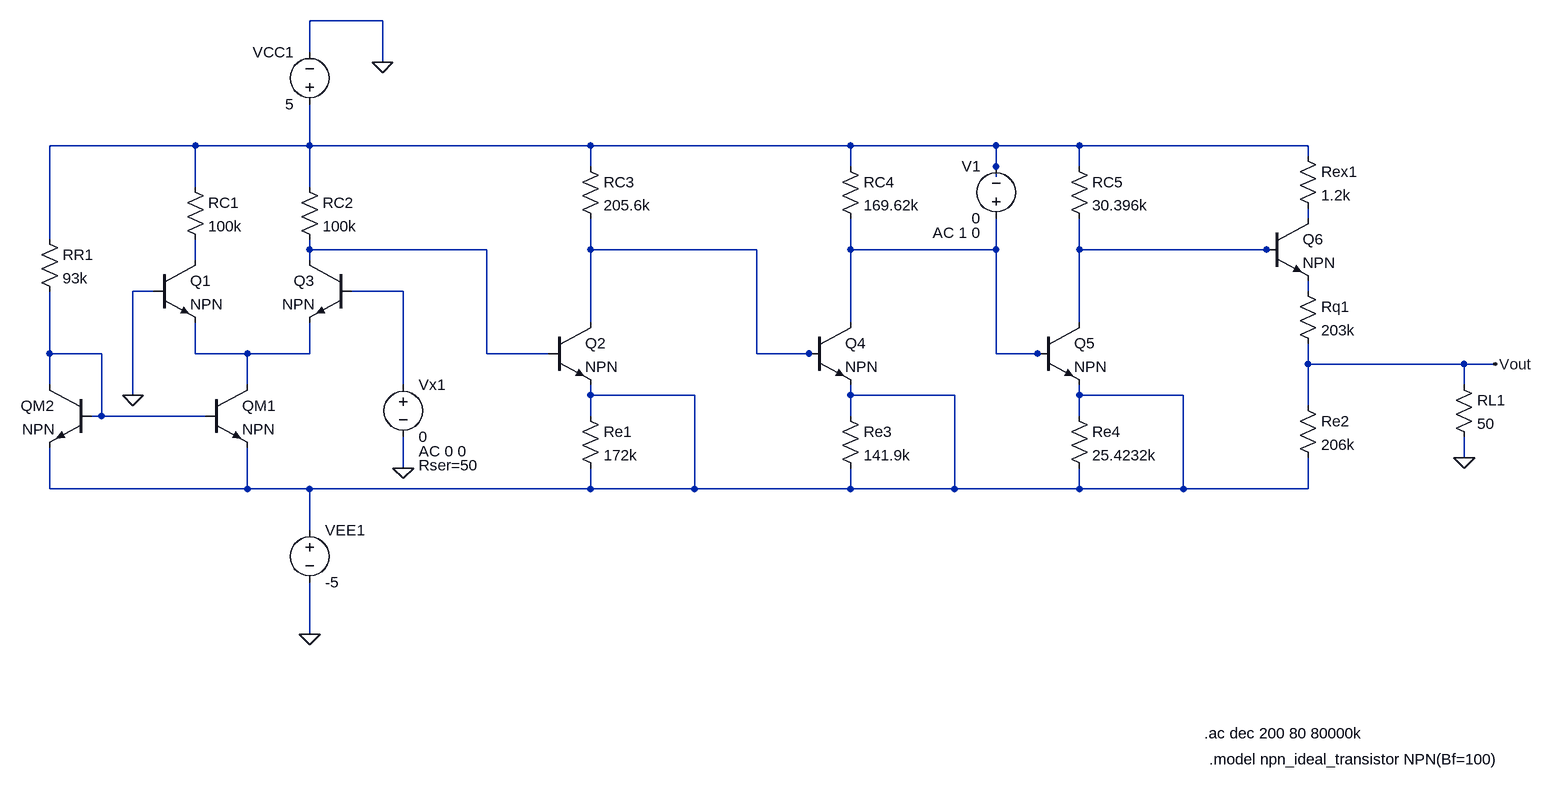
[diagram p0: schematic Draft1.asc]
Draft1.asc, the LTspice schematic file:
Version 4
SHEET 1 1828 992
WIRE 48 -160 -64 -160
WIRE -64 -112 -64 -160
WIRE 48 -96 48 -160
WIRE -240 32 -464 32
WIRE -64 32 -64 -32
WIRE -64 32 -240 32
WIRE 368 32 -64 32
WIRE 768 32 368 32
WIRE 992 32 768 32
WIRE 1120 32 992 32
WIRE 1472 32 1120 32
WIRE 1472 48 1472 32
WIRE 368 64 368 32
WIRE 768 64 768 32
WIRE 992 64 992 32
WIRE 1120 64 1120 32
WIRE 992 80 992 64
WIRE -240 96 -240 32
WIRE -64 96 -64 32
WIRE 1472 144 1472 128
WIRE -464 176 -464 32
WIRE -64 192 -64 176
WIRE 208 192 -64 192
WIRE 368 192 368 144
WIRE 624 192 368 192
WIRE 768 192 768 144
WIRE 992 192 992 144
WIRE 992 192 768 192
WIRE 1120 192 1120 144
WIRE 1408 192 1120 192
WIRE 1424 192 1408 192
WIRE -240 208 -240 176
WIRE -64 208 -64 192
WIRE -304 256 -336 256
WIRE 80 256 0 256
WIRE 1472 256 1472 240
WIRE 368 304 368 192
WIRE 768 304 768 192
WIRE 1120 304 1120 192
WIRE -464 352 -464 256
WIRE -384 352 -464 352
WIRE -240 352 -240 304
WIRE -160 352 -240 352
WIRE -64 352 -64 304
WIRE -64 352 -160 352
WIRE 208 352 208 192
WIRE 304 352 208 352
WIRE 624 352 624 192
WIRE 704 352 624 352
WIRE 720 352 704 352
WIRE 992 352 992 192
WIRE 1056 352 992 352
WIRE 1072 352 1056 352
WIRE 1472 368 1472 336
WIRE 1712 368 1472 368
WIRE 1760 368 1712 368
WIRE -464 400 -464 352
WIRE -160 400 -160 352
WIRE 80 400 80 256
WIRE 1712 400 1712 368
WIRE -336 416 -336 256
WIRE 368 416 368 400
WIRE 528 416 368 416
WIRE 768 416 768 400
WIRE 928 416 768 416
WIRE 1120 416 1120 400
WIRE 1280 416 1120 416
WIRE 1472 432 1472 368
WIRE -384 448 -384 352
WIRE -384 448 -400 448
WIRE -224 448 -384 448
WIRE 368 448 368 416
WIRE 768 448 768 416
WIRE 1120 448 1120 416
WIRE 1712 512 1712 480
WIRE 80 528 80 480
WIRE -464 560 -464 496
WIRE -160 560 -160 496
WIRE -160 560 -464 560
WIRE -64 560 -160 560
WIRE 368 560 368 528
WIRE 368 560 -64 560
WIRE 528 560 528 416
WIRE 528 560 368 560
WIRE 768 560 768 528
WIRE 768 560 528 560
WIRE 928 560 928 416
WIRE 928 560 768 560
WIRE 1120 560 1120 528
WIRE 1120 560 928 560
WIRE 1280 560 1280 416
WIRE 1280 560 1120 560
WIRE 1472 560 1472 512
WIRE 1472 560 1280 560
WIRE -64 624 -64 560
WIRE -64 784 -64 704
FLAG -64 784 0
FLAG 48 -96 0
FLAG 80 528 0
FLAG 1712 512 0
FLAG 1760 368 Vout
FLAG -336 416 0
SYMBOL res -256 80 R0
SYMATTR InstName RC1
SYMATTR Value 100k
SYMBOL res -80 80 R0
SYMATTR InstName RC2
SYMATTR Value 100k
SYMBOL Res 352 432 R0
SYMATTR InstName Re1
SYMATTR Value 172k
SYMBOL Res -480 160 R0
SYMATTR InstName RR1
SYMATTR Value 93k
SYMBOL Res 352 48 R0
SYMATTR InstName RC3
SYMATTR Value 205.6k
SYMBOL npn -304 208 R0
SYMATTR InstName Q1
SYMBOL npn 304 304 R0
SYMATTR InstName Q2
SYMBOL npn -224 400 R0
SYMATTR InstName QM1
SYMBOL npn -400 400 M0
SYMATTR InstName QM2
SYMBOL npn 0 208 M0
SYMATTR InstName Q3
SYMBOL voltage -64 608 R0
SYMATTR InstName VEE1
SYMATTR Value -5
SYMBOL voltage -64 -16 R180
WINDOW 0 24 96 Left 2
WINDOW 3 24 16 Left 2
SYMATTR InstName VCC1
SYMATTR Value 5
SYMBOL voltage 80 384 R0
WINDOW 123 24 118 Left 2
WINDOW 39 24 140 Left 2
SYMATTR Value2 AC 0 0
SYMATTR SpiceLine Rser=50
SYMATTR InstName Vx1
SYMATTR Value 0
SYMBOL Res 1456 416 R0
SYMATTR InstName Re2
SYMATTR Value 206k
SYMBOL Res 1696 384 R0
SYMATTR InstName RL1
SYMATTR Value 50
SYMBOL Res 752 432 R0
SYMATTR InstName Re3
SYMATTR Value 141.9k
SYMBOL Res 752 48 R0
SYMATTR InstName RC4
SYMATTR Value 169.62k
SYMBOL npn 704 304 R0
SYMATTR InstName Q4
SYMBOL Res 1456 240 R0
SYMATTR InstName Rq1
SYMATTR Value 203k
SYMBOL Res 1104 432 R0
SYMATTR InstName Re4
SYMATTR Value 25.4232k
SYMBOL Res 1104 48 R0
SYMATTR InstName RC5
SYMATTR Value 30.396k
SYMBOL npn 1056 304 R0
SYMATTR InstName Q5
SYMBOL npn 1408 144 R0
SYMATTR InstName Q6
SYMBOL Res 1456 32 R0
SYMATTR InstName Rex1
SYMATTR Value 1.2k
SYMBOL Voltage 992 160 R180
WINDOW 0 24 96 Left 2
WINDOW 3 24 16 Left 2
WINDOW 123 24 -6 Left 2
SYMATTR InstName V1
SYMATTR Value 0
SYMATTR Value2 AC 1 0
TEXT 1312 936 Left 2 !.ac dec 200 80 80000k
TEXT 1320 976 Left 2 !.model npn_ideal_transistor NPN(Bf=100)

The netlist it stands for:
* Draft1.asc
RC1 N001 N007 100k
RC2 N001 N003 100k
Re1 N012 N012 172k
RR1 N001 N010 93k
RC3 N001 N004 205.6k
Q1 N007 0 N011 0 NPN
Q2 N004 N003 N012 0 NPN
QM1 N011 N010 N012 0 NPN
QM2 N010 N010 N012 0 NPN
Q3 N003 N008 N011 0 NPN
VEE1 N012 0 -5
VCC1 N001 0 5
Vx1 N008 0 0 AC 0 0 Rser=50
Re2 Vout N012 206k
RL1 Vout 0 50
Re3 N012 N012 141.9k
RC4 N001 N005 169.62k
Q4 N005 N004 N012 0 NPN
Rq1 N009 Vout 203k
Re4 N012 N012 25.4232k
RC5 N001 N006 30.396k
Q5 N006 N005 N012 0 NPN
Q6 N002 N006 N009 0 NPN
Rex1 N001 N002 1.2k
V1 N005 N001 0 AC 1 0
.model NPN NPN
.model PNP PNP
.lib standard.bjt
.ac dec 200 80 80000k
.model npn_ideal_transistor NPN(Bf=100)
.backanno
.end